# EAGLE design Gleissperrsignal_Shapeways_3Ader_JL_025_01_09 (EAGLE 5.10)
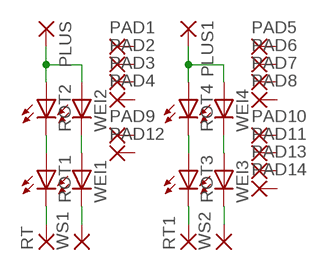
[diagram p0: schematic, sheet 1]

## Parts
PAD1  SMD-RECT0,4R  [SMD0,4_R]
PAD2  SMD-RECT0,4R  [SMD0,4_R]
PAD3  SMD-RECT0,4R  [SMD0,4_R]
PAD4  SMD-RECT0,4R  [SMD0,4_R]
PAD5  SMD-LONG0,4-0,8  [SMD0,4-0,8]
PAD6  SMD-LONG0,4-0,8  [SMD0,4-0,8]
PAD7  SMD-LONG0,4-0,8  [SMD0,4-0,8]
PAD8  SMD-LONG0,4-0,8  [SMD0,4-0,8]
PAD9  SMD-RECT0,6R  [SMD0,6_R]
PAD10  SMD-LONG0,6-0,8  [SMD0,6-0,8]
PAD11  SMD-LONG0,6-0,8  [SMD0,6-0,8]
PAD12  SMD-RECT0,6R  [SMD0,6_R]
PAD13  SMD-LONG0,6-0,8  [SMD0,6-0,8]
PAD14  SMD-LONG0,6-0,8  [SMD0,6-0,8]
PLUS  SMD-RECT0,6  [SMD0,6-0,6]
PLUS1  SMD-RECT0,6  [SMD0,6-0,6]
ROT1  LEDCHIPLED_0402  [CHIPLED_0402]
ROT2  LEDCHIPLED_0402  [CHIPLED_0402]
ROT3  LEDCHIPLED_0402  [CHIPLED_0402]
ROT4  LEDCHIPLED_0402  [CHIPLED_0402]
RT  SMD-RECT0,6  [SMD0,6-0,6]
RT1  SMD-RECT0,6  [SMD0,6-0,6]
WEI1  LEDCHIPLED_0402  [CHIPLED_0402]
WEI2  LEDCHIPLED_0402  [CHIPLED_0402]
WEI3  LEDCHIPLED_0402  [CHIPLED_0402]
WEI4  LEDCHIPLED_0402  [CHIPLED_0402]
WS1  SMD-RECT0,6  [SMD0,6-0,6]
WS2  SMD-RECT0,6  [SMD0,6-0,6]

## Nets
N$1: WEI1.C WS1.1(P)
N$2: WEI1.A WEI2.C
N$3: ROT1.C RT.1(P)
N$4: ROT1.A ROT2.C
N$5: ROT3.C RT1.1(P)
N$6: ROT3.A ROT4.C
N$7: WEI3.A WEI4.C
N$8: WEI3.C WS2.1(P)
PLUS: PLUS.1(P) ROT2.A WEI2.A
PLUS1: PLUS1.1(P) ROT4.A WEI4.A
Unconnected: PAD1.1(P) PAD2.1(P) PAD3.1(P) PAD4.1(P) PAD5.1(P) PAD6.1(P) PAD7.1(P) PAD8.1(P) PAD9.1(P) PAD10.1(P) PAD11.1(P) PAD12.1(P) PAD13.1(P) PAD14.1(P)

## Library data of the parts
PAD1-PAD4 PAD9 PAD12 PLUS PLUS1 RT RT1 WS1 WS2 = wirepad:SMD-RECT
PAD5-PAD8 PAD10 PAD11 PAD13 PAD14 = wirepad:SMD-LONG
ROT1-ROT4 WEI1-WEI4 = led:LED: LED OSRAM: - CHIPLED LG R971, LG N971, LY N971, LG Q971, LY Q971, LO R971, LY R971 LH N974, LH R974 LS Q976, LO Q976, LY Q976 LO Q996 - Hyper CHIPLED LW Q18S LB Q993, LB Q99A, LB R99A - SideLED LS A670, LO A670, LY A670, LG A670, LP A670 LB A673, LV A673, LT A673, LW A673 LH A674 LY A675 LS A676, LA A676, LO A676, LY A676, LW A676 LS A679, LY A679, LG A679 - Hyper Micro SIDELED® LS Y876, LA Y876, LO Y876, LY Y876 LT Y87S - SmartLED LW L88C, LW L88S LB L89C, LB L89S, LG L890 LS L89K, LO L89K, LY L89K LS L896, LA L896, LO L896, LY L896 - TOPLED LS T670, LO T670, LY T670, LG T670, LP T670 LSG T670, LSP T670, LSY T670, LOP T670, LYG T670 LG T671, LOG T671, LSG T671 LB T673, LV T673, LT T673, LW T673 LH T674 LS T676, LA T676, LO T676, LY T676, LB T676, LH T676, LSB T676, LW T676 LB T67C, LV T67C, LT T67C, LS T67K, LO T67K, LY T67K, LW E67C LS E67B, LA E67B, LO E67B, LY E67B, LB E67C, LV E67C, LT E67C LW T67C LS T679, LY T679, LG T679 LS T770, LO T770, LY T770, LG T770, LP T770 LB T773, LV T773, LT T773, LW T773 LH T774 LS E675, LA E675, LY E675, LS T675 LS T776, LA T776, LO T776, LY T776, LB T776 LHGB T686 LT T68C, LB T68C - Hyper Mini TOPLED® LB M676 - Mini TOPLED Santana® LG M470 LS M47K, LO M47K, LY M47K Source: http://www.osram.convergy.de LUXEON: - LUMILED® LXK2-PW12-R00, LXK2-PW12-S00, LXK2-PW14-U00, LXK2-PW14-V00 LXK2-PM12-R00, LXK2-PM12-S00, LXK2-PM14-U00 LXK2-PE12-Q00, LXK2-PE12-R00, LXK2-PE12-S00, LXK2-PE14-T00, LXK2-PE14-U00 LXK2-PB12-K00, LXK2-PB12-L00, LXK2-PB12-M00, LXK2-PB14-N00, LXK2-PB14-P00, LXK2-PB14-Q00 LXK2-PR12-L00, LXK2-PR12-M00, LXK2-PR14-Q00, LXK2-PR14-R00 LXK2-PD12-Q00, LXK2-PD12-R00, LXK2-PD12-S00 LXK2-PH12-R00, LXK2-PH12-S00 LXK2-PL12-P00, LXK2-PL12-Q00, LXK2-PL12-R00 Source: www.luxeon.com KINGBRIGHT: KA-3528ASYC Source: www.kingbright.com

## Board
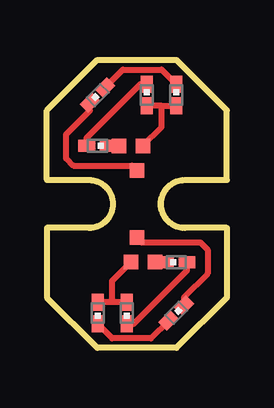
[diagram p1: board, top side]
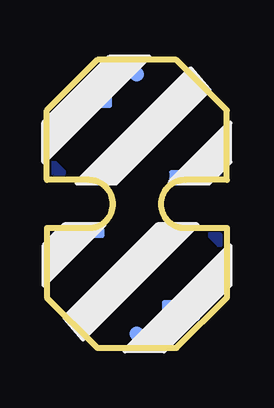
[diagram p2: board, bottom side, seen from below]

No outline drawn. Coordinates in mm, seen from the top.
Copper layers (1*16): Top 0.035mm / dielectric 1.5mm / Bottom 0.035mm
Design rules "default": minimum track width 10mil, minimum drill 24mil, track to track 8mil, track to pad 8mil, pad to pad 8mil, via to via 8mil, smd to smd 8mil, copper to edge 40mil, drill to drill 8mil, minimum pad ring 10mil, minimum via ring 8mil, stop-mask expansion 4mil, vias tented up to drill 0mil, thermal gap 10mil
Milling: 18 lines

### Footprints (pad centres in the part's own frame; a part is rotated, then mirrored left to right if it is on the bottom)
SMD0,4_R = smd 0.4 x 0.4: 1 0,0
SMD0,4-0,8 = smd 0.4 x 0.8: 1 0,0
SMD0,6_R = smd 0.6 x 0.6: 1 0,0
SMD0,6-0,8 = smd 0.6 x 0.8: 1 0,0
SMD0,6-0,6 = smd 0.6 x 0.6: 1 0,0
CHIPLED_0402 = smd 0.5 x 0.7: A 0,-0.45; C 0,0.45

### Placement (x,y rotation side)
PAD1  6.2,-4.7 0 bottom
PAD2  1.3,-4.7 0 bottom
PAD3  6.2,4.7 0 bottom
PAD4  1.3,4.7 0 bottom
PAD5  5.5,-1.2 270 bottom
PAD6  2,-1.2 270 bottom
PAD7  5.5,1.2 270 bottom
PAD8  2,1.2 270 bottom
PAD9  3.75,5.4 0 bottom
PAD10  5.2,-4.3 270 bottom
PAD11  2.3,-4.3 270 bottom
PAD12  3.75,-5.4 0 bottom
PAD13  5.2,4.3 270 bottom
PAD14  2.3,4.3 270 bottom
PLUS  4,2.42 0 top
PLUS1  3.5,-2.42 0 top
ROT1  2.11,4.54 135 top
ROT2  5.39,4.54 0 top
ROT3  5.39,-4.54 315 top
ROT4  2.11,-4.54 180 top
RT  3.75,1.4 0 top
RT1  3.75,-1.4 0 top
WEI1  2.11,2.42 270 top
WEI2  4.17,4.54 0 top
WEI3  5.39,-2.42 90 top
WEI4  3.33,-4.54 180 top
WS1  3,2.42 0 top
WS2  4.5,-2.42 0 top

### Tracks (layer width: path | path; a pad name or v marks a point on that pad's centre or on a via)
N$1
  Top 0.254: WEI1.C WS1.1
N$2
  Top 0.254: WEI2.C 3.89,4.99 1.66,2.76 WEI1.A
N$3
  Top 0.254: RT.1 3.55,1.6 1.1,1.6 0.8,1.9 0.8,2.9 1.79,3.89 ROT1.C
N$4
  Top 0.254: ROT2.C 4.78,5.6 3.17,5.6 ROT1.A
N$5
  Top 0.254: RT1.1 3.95,-1.6 6.4,-1.6 6.7,-1.9 6.7,-2.9 5.71,-3.89 ROT3.C
N$6
  Top 0.254: ROT4.C 2.72,-5.6 4.33,-5.6 ROT3.A
N$7
  Top 0.254: WEI3.A 5.84,-2.76 3.61,-4.99 WEI4.C
N$8
  Top 0.254: WEI3.C WS2.1
N$10
  pour Bottom: 0.3,1.3 0.3,1.7 0.7,1.3
  pour Bottom: 7.2,1.3 6.8,1.3 7.2,1.7
  pour Bottom: 7.2,-1.3 7.2,-1.7 6.8,-1.3
  pour Bottom: 0.3,-1.3 0.7,-1.3 0.3,-1.7
PLUS
  Top 0.254: 4.78,4.09 WEI2.A | 4.78,4.09 ROT2.A | PLUS.1 4.78,3.2 4.78,4.09
PLUS1
  Top 0.254: PLUS1.1 2.72,-3.2 2.72,-4.09 | 2.72,-4.09 ROT4.A | WEI4.A 2.72,-4.09